# Altium schematic sheet 02_USB_Bridge.SchDoc: USB Bridge
size A; Revision: A; SheetNumber: 2; SheetTotal: 8; ECE315_Project_Name: ECE453 MCU Base Project
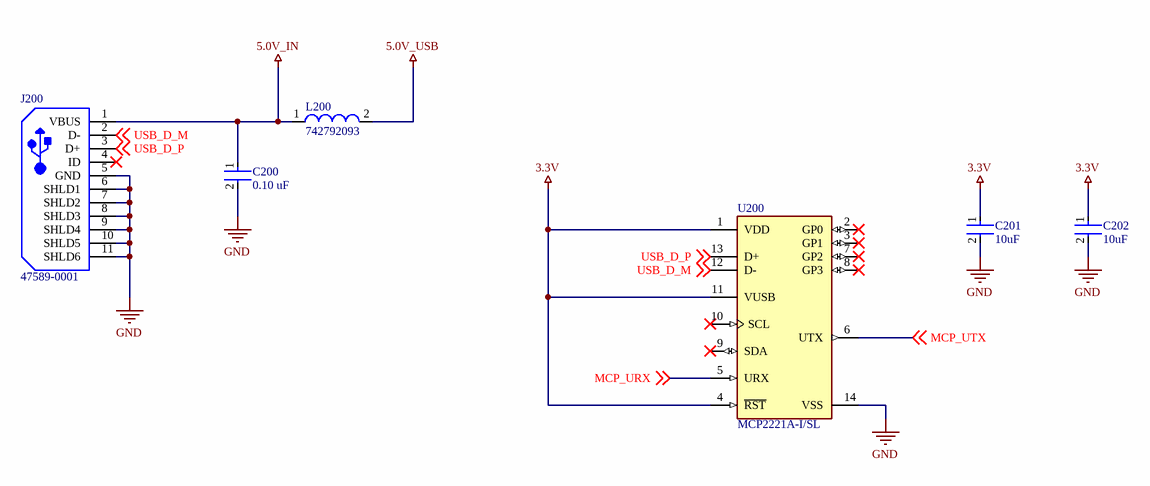
[diagram p0: 02_USB_Bridge.SchDoc]

## Parts
C200  0.10 uF  [FP-C0805C-DN-MFG]
C201  10uF  [FP-C0805C-DG-MFG]
C202  10uF  [FP-C0805C-DG-MFG]
J200  47589-0001  [MOLX-47589-0001_V]
L200  742792093  [SMD-0805]
U200  MCP2221A-I/SL  [FP-C04-065-SL-MFG]

## Nets
3.3V: C201.1 C202.1 U200.1(VDD) U200.4(~{RST}) U200.11(VUSB)
5.0V_IN: C200.1 J200.1(VBUS) L200.1
5.0V_USB: L200.2
GND: C200.2 C201.2 C202.2 J200.5(GND) J200.6(SHLD1) J200.7(SHLD2) J200.8(SHLD3) J200.9(SHLD4) J200.10(SHLD5) J200.11(SHLD6) U200.14(VSS)
MCP_URX: U200.5(URX) ; off-sheet MCP_URX
MCP_UTX: U200.6(UTX) ; off-sheet MCP_UTX
USB_D_M: J200.2(D-) U200.12(D-) ; off-sheet USB_D_M
USB_D_P: J200.3(D+) U200.13(D+) ; off-sheet USB_D_P

Not connected (* = marked no-connect by the designer): J200 4(ID)*; U200 2(GP0)* 3(GP1)* 7(GP2)* 8(GP3)* 9(SDA)* 10(SCL)*

## Notes on the sheet
- Title:
- Size:
- A
- Project
- Rev:
- Sheet:
- of
- College of Engineering
- 1415 Engineering Drive
- Madison, WI 53706

## Library data of the parts
C200 = CMP-2007-00279-2: CAP CER 0.1UF 50V X7R 0805; Manufacturer Part Number: C0805C104K5RACTU; Manufacturer: KEMET; Value: 0.10 μF; Tolerance: 0.1; Temperature Coefficient: 30ppm/°C; Material: Ceramic; Device Class L2: Capacitors; Temperature Range Low: -55°C; Voltage Rating: 50 V; Digikey Description: CAP CER 0.1UF 50V X7R 0805; Category: Cap; ComponentLink2Description: Datasheet; Octopart: https://octopart.com/c0805c104k5ractu-kemet-143926; RoHS: TRUE; ComponentLink2URL: https://content.kemet.com/datasheets/KEM_C1003_C0G_SMD.pdf; Temperature Characteristic: X7R; Temperature: -55°C to +125°C; Height: 0.88mm; Temperature Range High: +125°C; Device Class L1: Passive Components; Automotive: No; Lead Free: Yes; Ipc Land Pattern Name: CAPC200125X78; Device Class L3: Ceramic Capacitors; Mouser Description: Cap Ceramic 0.1uF 50V X7R 10% SMD 2.0 x 1.2 mm 125 C Paper T/R; Capacitance: 0.10 μF; Package: C0805C-DN
C201 C202 = CMP-2007-03243-2: CAP CER 10UF 10V X5R 0805; Manufacturer Part Number: C0805C106K8PACTU; Manufacturer: Kemet; 3DS Part Number: 220-00001; Tolerance: 10%; Temperature Coefficient: 15%; Material: Ceramic; Device Class L2: Capacitors; Device Class L1: Passive Components; ComponentLink2URL: https://content.kemet.com/datasheets/KEM_C1006_X5R_SMD.pdf; Height: 1.4mm; Lead Free: Yes; Digikey Description: CAP CER 10UF 10V X5R 0805; Octopart: https://octopart.com/c0805c106k8pactu-kemet-98697; Capacitance: 10uF; Value: 10uF; Temperature Range Low: -55°C; Temperature: -55°C to +85°C; Automotive: No; Mouser Description: CAP CER 10UF 10V X5R 0805; Ipc Land Pattern Name: CAPC200125X125; Temperature Range High: +85°C; Voltage: 10V; RoHS: TRUE; Device Class L3: Ceramic Capacitors; ComponentLink2Description: Datasheet; Voltage Rating: 10V; Package: C0805C-DG; Temperature Characteristic: X5R; Category: Cap
J200 = CMP-2000-05610-1: Right Angle Female Type AB Micro USB Connector, 30 V, 1.8 A, -30 to 85 degC, RoHS, Tape and Reel; Number of Ports: 1Port; Current Rating: 1.8A; Brand: Molex; Connector Type: MicroUSBTypeABreceptacle; Number of Contacts: 5Contact; Voltage Rating: 30VAC; Color: Black; Product: MicroUSBTypeABConnectors; Package URL: http://www.molex.com/pdm_docs/sd/475890001_sd.pdf; Contact Plating: Gold; Datasheet URL: http://www.molex.com/webdocs/datasheets/pdf/en-us/0475890001_IO_CONNECTORS.pdf; Operating Temperature Range: -20Cto+85C; Termination Style: SMD/SMT; Mounting Angle: Right; Package Reference: 47589-0001; Gender: Female; Package Description: Micro USB Connector, Pitch 0.65 mm, 5 Positions, Body 7.5 x 5.6 mm; Mounting Technology: SurfaceMount; Contact Material: CopperAlloy; Packaging: Reel; RoHS: True; Standard: USB; Manufacturer URL: http://www.molex.com/; Manufacturer: Molex; Datasheet Version: 12/2016; Product Category: USBConnectors; Series: 47589
L200 = CMP-0220-00169-1: SMD EMI Suppression Ferrite Bead WE-CBF, Z = 2200 Ohm; DatasheetVersion: Dec-2005; ComponentLink2URL: http://www.we-online.de/katalog/media/pdf/742792093.pdf; PackageDescription: Chip Inductor, 2-Leads, Body 2.0 x 1.2 mm; Impedance: 2200 Ohm; ComponentLink2Description: Datasheet; ComponentLink1Description: Manufacturer Link; PackageReference: SMD-0805; ComponentLink1URL: http://www.we-online.com; PackageVersion: 2005
U200 = CMP-06284-000011-1: IC USB TO I2C/UART 14SOIC; Manufacturer: Microchip; Min Supply Voltage: 3V; Usb Standard: USB 2.0; Max Supply Voltage: 5.5V; Nominal Supply Current: 10-13mA; Automotive Grade: Grade 3; Interface: I2C,UART,USB; Standoff Height: 0.1mm; Max Junction Temp: +150°C; Data Rate: 12Mbits/s; Lead Free: Yes; Height: 1.75mm; Octopart: https://octopart.com/mcp2221a-i%2Fsl-microchip-71704986; Package: C04-065-SL; Digikey Description: IC USB TO I2C/UART 14SOIC; Temperature Range Low: -40°C; Temperature: -40°C to +85°C; Category: IC; Temperature Range High: +85°C; Ambient Temperature Range Low: -40°C; Device Class L1: Integrated Circuits (ICs); Footprint Url: http://ww1.microchip.com/downloads/en/DeviceDoc/14L%20SOIC%203_90%20mm%20%28SL%29%20C04-00065d.pdf; Automotive: Yes; ComponentLink2URL: http://ww1.microchip.com/downloads/en/DeviceDoc/20005565B.pdf; Ambient Temperature Range High: +85°C; RoHS: TRUE; Device Class L3: USB Interface ICs; ComponentLink2Description: Datasheet; Device Class L2: Interface ICs; Manufacturer Part Number: MCP2221A-I/SL; Ipc Land Pattern Name: SOIC127P600X175-14